# EAGLE design HotplateReflowSchematic (EAGLE 7.6.0)
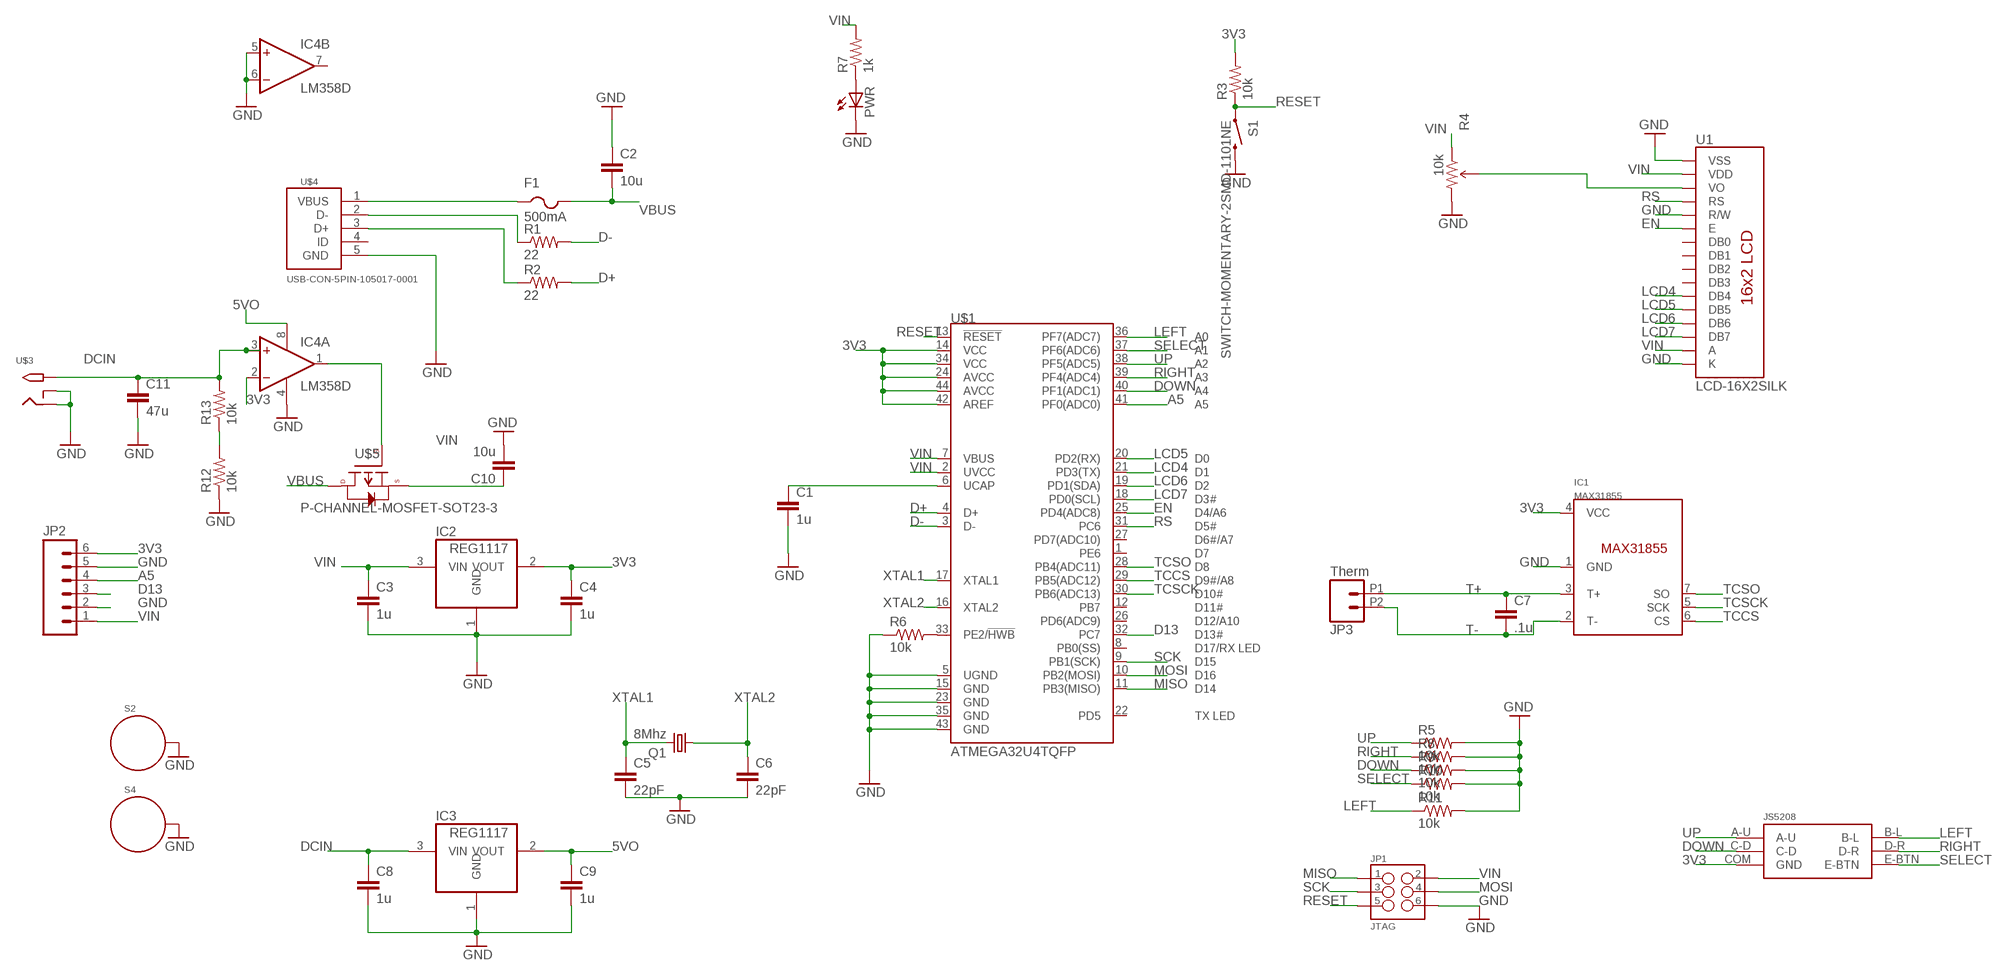
[diagram p0: schematic, sheet 1]

## Parts
C1  1u  CAP0603-CAP  [0603-CAP]
C2  10u  CAP0603-CAP  [0603-CAP]
C3  1u  CAP0603-CAP  [0603-CAP]
C4  1u  CAP0603-CAP  [0603-CAP]
C5  22pF  CAP0603-CAP  [0603-CAP]
C6  22pF  CAP0603-CAP  [0603-CAP]
C7  .1u  CAP0603-CAP  [0603-CAP]
C8  1u  CAP0603-CAP  [0603-CAP]
C9  1u  CAP0603-CAP  [0603-CAP]
C10  10u  CAP0603-CAP  [0603-CAP]
C11  47u  CAP0603-CAP  [0603-CAP]
F1  500mA  PTCFUSE-1812  [1812]
IC1  MAX31855  [SOIC8]
IC2  REG1117  [SOT223]
IC3  REG1117  [SOT223]
IC4  LM358D  [SO08]
JP1  JTAG  M03X2SHROUD  [2X3-SHROUDED]
JP2  M06LOCK  [1X06_LOCK]
JP3  Therm  M022.54MM_SCREWTERM  [1X02_2.54_SCREWTERM]
PWR  LEDCHIP-LED0603  [CHIP-LED0603]
Q1  8Mhz  CRYSTALHC49UP  [HC49UP]
R1  22  RESISTOR0603-RES  [0603-RES]
R2  22  RESISTOR0603-RES  [0603-RES]
R3  10k  RESISTOR0603-RES  [0603-RES]
R4  10k  TRIMPOT  [TRIMPOT-5MM-V2]
R5  10k  RESISTOR0603-RES  [0603-RES]
R6  10k  RESISTOR0603  [0603-RES]
R7  1k  RESISTOR0603  [0603-RES]
R8  10k  RESISTOR0603-RES  [0603-RES]
R9  10k  RESISTOR0603-RES  [0603-RES]
R10  10k  RESISTOR0603-RES  [0603-RES]
R11  10k  RESISTOR0603-RES  [0603-RES]
R12  10k  RESISTOR0603-RES  [0603-RES]
R13  10k  RESISTOR0603-RES  [0603-RES]
S1  SWITCH-MOMENTARY-2SMD-1101NE  [TACTILE-SWITCH-1101NE]
S2  STANDOFF_ELECTRICAL  [STANDOFF-ELECTRICAL]
S4  STANDOFF_ELECTRICAL  [STANDOFF-ELECTRICAL]
U1  LCD-16X2SILK  [LCD-16X2]
U$1  ATMEGA32U4TQFP  [SPARKFUN-DIGITALIC_TQFP44]
U$2  JS5208  [JS5208_PKG]
U$3  2.1MMJACKTHM  [PJ-102A]
U$4  USB-CON-5PIN-105017-0001  [USB-MICRO-MOLEX-105017-0001]
U$5  P-CHANNEL-MOSFET-SOT23-3  [SOT23-3]

## Nets
3V3: C4.1 IC1.4(VCC) IC2.2(VOUT) IC4.2(A:-IN) JP2.6 R3.2 U$1.14(VCC) U$1.24(AVCC) U$1.34(VCC) U$1.42(AREF) U$1.44(AVCC) U$2.COM(GND)
5VO: C9.1 IC3.2(VOUT) IC4.8(P:V+)
A5: JP2.4 U$1.41(PF0(ADC0))
D13: JP2.3 U$1.32(PC7)
D+: R2.2 U$1.4(D+)
D-: R1.2 U$1.3(D-)
DCIN: C8.1 C11.1 IC3.3(VIN) IC4.3(A:+IN) R13.2 U$3.TIP
DOWN: R9.1 U$1.40(PF1(ADC1)) U$2.C-D
EN: U1.6(E) U$1.25(PD4(ADC8))
GND: C1.2 C2.1 C3.2 C4.2 C5.2 C6.2 C8.2 C9.2 C10.2 C11.2 IC1.1(GND) IC2.1(GND) IC3.1(GND) IC4.4(P:V-) IC4.5(B:+IN) IC4.6(B:-IN) JP1.6 JP2.2 JP2.5 PWR.C R4.C(CW) R5.2 R6.1 R8.2 R9.2 R10.2 R11.2 R12.1 S1.2 S2.P1 S4.P1 U1.1(VSS) U1.5(R/W) U1.16(K) U$1.5(UGND) U$1.15(GND) U$1.23(GND) U$1.35(GND) U$1.43(GND) U$3.RING U$3.RING_SW U$4.5(GND)
LCD4: U1.11(DB4) U$1.21(PD3(TX))
LCD5: U1.12(DB5) U$1.20(PD2(RX))
LCD6: U1.13(DB6) U$1.19(PD1(SDA))
LCD7: U1.14(DB7) U$1.18(PD0(SCL))
LEFT: R11.1 U$1.36(PF7(ADC7)) U$2.B-L
MISO: JP1.1 U$1.11(PB3(MISO))
MOSI: JP1.4 U$1.10(PB2(MOSI))
N$1: R4.B(WIPER) U1.3(VO)
N$2: F1.1 U$4.1(VBUS)
N$3: R1.1 U$4.2(D-)
N$4: R2.1 U$4.3(D+)
N$5: C1.1 U$1.6(UCAP)
N$6: PWR.A R7.1
N$7: R6.2 U$1.33(PE2/!HWB)
N$8: R12.2 R13.1
N$9: IC4.1(A:OUT) U$5.1(G)
RESET: JP1.5 R3.1 S1.1 U$1.13(!RESET)
RIGHT: R8.1 U$1.39(PF4(ADC4)) U$2.D-R
RS: U1.4(RS) U$1.31(PC6)
SCK: JP1.3 U$1.9(PB1(SCK))
SELECT: R10.1 U$1.37(PF6(ADC6)) U$2.E-BTN
T+: C7.1 IC1.3(T+) JP3.P1
T-: C7.2 IC1.2(T-) JP3.P2
TCCS: IC1.6(CS) U$1.29(PB5(ADC12))
TCSCK: IC1.5(SCK) U$1.30(PB6(ADC13))
TCSO: IC1.7(SO) U$1.28(PB4(ADC11))
UP: R5.1 U$1.38(PF5(ADC5)) U$2.A-U
VBUS: C2.2 F1.2 U$5.3(D)
VIN: C3.1 C10.1 IC2.3(VIN) JP1.2 JP2.1 R4.A(CCW) R7.2 U1.2(VDD) U1.15(A) U$1.2(UVCC) U$1.7(VBUS) U$5.2(S)
XTAL1: C5.1 Q1.2 U$1.17(XTAL1)
XTAL2: C6.1 Q1.1 U$1.16(XTAL2)
Unconnected: IC4.7(B:OUT) U1.7(DB0) U1.8(DB1) U1.9(DB2) U1.10(DB3) U$1.1(PE6) U$1.8(PB0(SS)) U$1.12(PB7) U$1.22(PD5) U$1.26(PD6(ADC9)) U$1.27(PD7(ADC10)) U$4.4(ID)

## Library data of the parts
C1-C7 C11 = SparkFun-Passives:CAP: Capacitor Standard 0603 ceramic capacitor, and 0.1" leaded capacitor.
C8-C10 = SparkFun-Capacitors:CAP: Capacitor Standard 0603 ceramic capacitor, and 0.1" leaded capacitor.
F1 = adafruit:PTCFUSE: PTC fuses, resettable thermistors
IC1 = AlexW-Eagle-Libraries:MAX31855
IC2 IC3 = burr-brown:REG1117: 800mA and 1A Low Dropout (LDO) Positive Regulator 1.8V, 2.5V, 2.85V, 3.3V, 5V, and Adj; MPN: REG1117; OC_FARNELL: 1097566; OC_NEWARK: 14P6981
IC4 = linear:LM358: OP AMP also LM158; LM258; LM2904 Source: http://cache.national.com/ds/LM/LM158.pdf
JP1 = SparkFun-Connectors:M03X2: 2x3 .1" header. Shrouded, with keying- CONN-10681 SMT- CONN-11415 Pogo pins- HW-11044; PROD_ID: CONN-10681
JP2 = SparkFun-Connectors:M06: Header 6 Standard 6-pin 0.1" header. Use with straight break away headers (SKU : PRT-00116), right angle break away headers (PRT-00553), swiss pins (PRT-00743), machine pins (PRT-00117), and female headers (PRT-00115). Molex polarized connector foot print use with SKU : PRT-08094 with associated crimp pins and housings. NOTES ON THE VARIANTS LOCK and LOCK_LONGPADS... This footprint was designed to help hold the alignment of a through-hole component (i.e. 6-pin header) while soldering it into place. You may notice that each hole has been shifted either up or down by 0.005 of an inch from it's more standard position (which is a perfectly straight line). This slight alteration caused the pins (the squares in the middle) to touch the edges of the holes. Because they are alternating, it causes a "brace" to hold the component in place. 0.005 has proven to be the perfect amount of "off-center" position when using our standard breakaway headers. Although looks a little odd when you look at the bare footprint, once you have a header in there, the alteration is very hard to notice. Also,if you push a header all the way into place, it is covered up entirely on the bottom side. This idea of altering the position of holes to aid alignment will be further integrated into the Sparkfun Library for other footprints. It can help hold any component with 3 or more connection pins.
JP3 = SparkFun-Connectors:M02: Standard 2-pin 0.1" header. Use with - straight break away headers ( PRT-00116) - right angle break away headers (PRT-00553) - swiss pins (PRT-00743) - machine pins (PRT-00117) - female headers (PRT-00115) Molex polarized connector foot print use with: PRT-08233 with associated crimp pins and housings. 2.54_SCREWTERM for use with PRT-10571. 3.5mm Screw Terminal footprints for PRT-08084 5mm Screw Terminal footprints for use with PRT-08432
PWR = adafruit:LED: LED OSRAM: - CHIPLED LG R971, LG N971, LY N971, LG Q971, LY Q971, LO R971, LY R971 LH N974, LH R974 LS Q976, LO Q976, LY Q976 LO Q996 - Hyper CHIPLED LW Q18S LB Q993, LB Q99A, LB R99A - SideLED LS A670, LO A670, LY A670, LG A670, LP A670 LB A673, LV A673, LT A673, LW A673 LH A674 LY A675 LS A676, LA A676, LO A676, LY A676, LW A676 LS A679, LY A679, LG A679 - Hyper Micro SIDELED® LS Y876, LA Y876, LO Y876, LY Y876 LT Y87S - SmartLED LW L88C, LW L88S LB L89C, LB L89S, LG L890 LS L89K, LO L89K, LY L89K LS L896, LA L896, LO L896, LY L896 - TOPLED LS T670, LO T670, LY T670, LG T670, LP T670 LSG T670, LSP T670, LSY T670, LOP T670, LYG T670 LG T671, LOG T671, LSG T671 LB T673, LV T673, LT T673, LW T673 LH T674 LS T676, LA T676, LO T676, LY T676, LB T676, LH T676, LSB T676, LW T676 LB T67C, LV T67C, LT T67C, LS T67K, LO T67K, LY T67K, LW E67C LS E67B, LA E67B, LO E67B, LY E67B, LB E67C, LV E67C, LT E67C LW T67C LS T679, LY T679, LG T679 LS T770, LO T770, LY T770, LG T770, LP T770 LB T773, LV T773, LT T773, LW T773 LH T774 LS E675, LA E675, LY E675, LS T675 LS T776, LA T776, LO T776, LY T776, LB T776 LHGB T686 LT T68C, LB T68C - Hyper Mini TOPLED® LB M676 - Mini TOPLED Santana® LG M470 LS M47K, LO M47K, LY M47K Source: http://www.osram.convergy.de/
Q1 = adafruit:CRYSTAL: CRYSTAL; OC_FARNELL: unknown; OC_NEWARK: unknown
R1-R3 R5 R8-R13 = SparkFun-Passives:RESISTOR: Resistor Basic schematic elements and footprints for 0603, 1206, and PTH resistors.
R4 = SparkFun-Electromechanical:TRIMPOT: Various small potentiometers for "set-and-forget" applications
R6 R7 = SparkFun-Resistors:RESISTOR: Resistor Basic schematic elements and footprints for 0603, 1206, and PTH resistors.
S1 = SparkFun-Electromechanical:SWITCH-MOMENTARY-2: Various NO switches- pushbuttons, reed, etc; PROD_ID: SWCH-00815
S2 S4 = SparkFun-Electromechanical:STANDOFF_ELECTRICAL: A standoff intended to be an electrically connected point. Pad size and stop size allow for a #4 Phillips pan screw head to make a solid connection to the board.
U1 = SparkFun-Displays:LCD-16X2: Standard text-only 16x2 parallel input LCD
U$1 = SparkFun-Retired:ATMEGA32U4: Atmel 44-pin 8-bit Microcontroller with 32KBytes of ISP Flash and USB Controller ----- Please use the QFN-44-NOPAD_1:1 package for the footprint of all boards using a 32U4. Route traces directly away from the pads as much as possible.; PROD_ID: IC-11161
U$2 = eswitch_js5208:JS5208
U$3 = adafruit:2.1MMJACK: 2.1mm x 5.5mm THM DC jack with internal switch. Digikey part #PJ-102A, 4UCON part #05537 2.1mm x 5.5mm SMT DC jack with internal switch. Digikey part #PJ-002A-SMT, 4UCON part #03267 By microbuilder.eu & adafruit.com
U$4 = GeekAmmo:USB-CON-5PIN: Molex Micro USB 105017-0001
U$5 = GeekAmmo:P-CHANNEL-MOSFET: P-Channel MOSFET Mode Field Effect Transistor

## Board
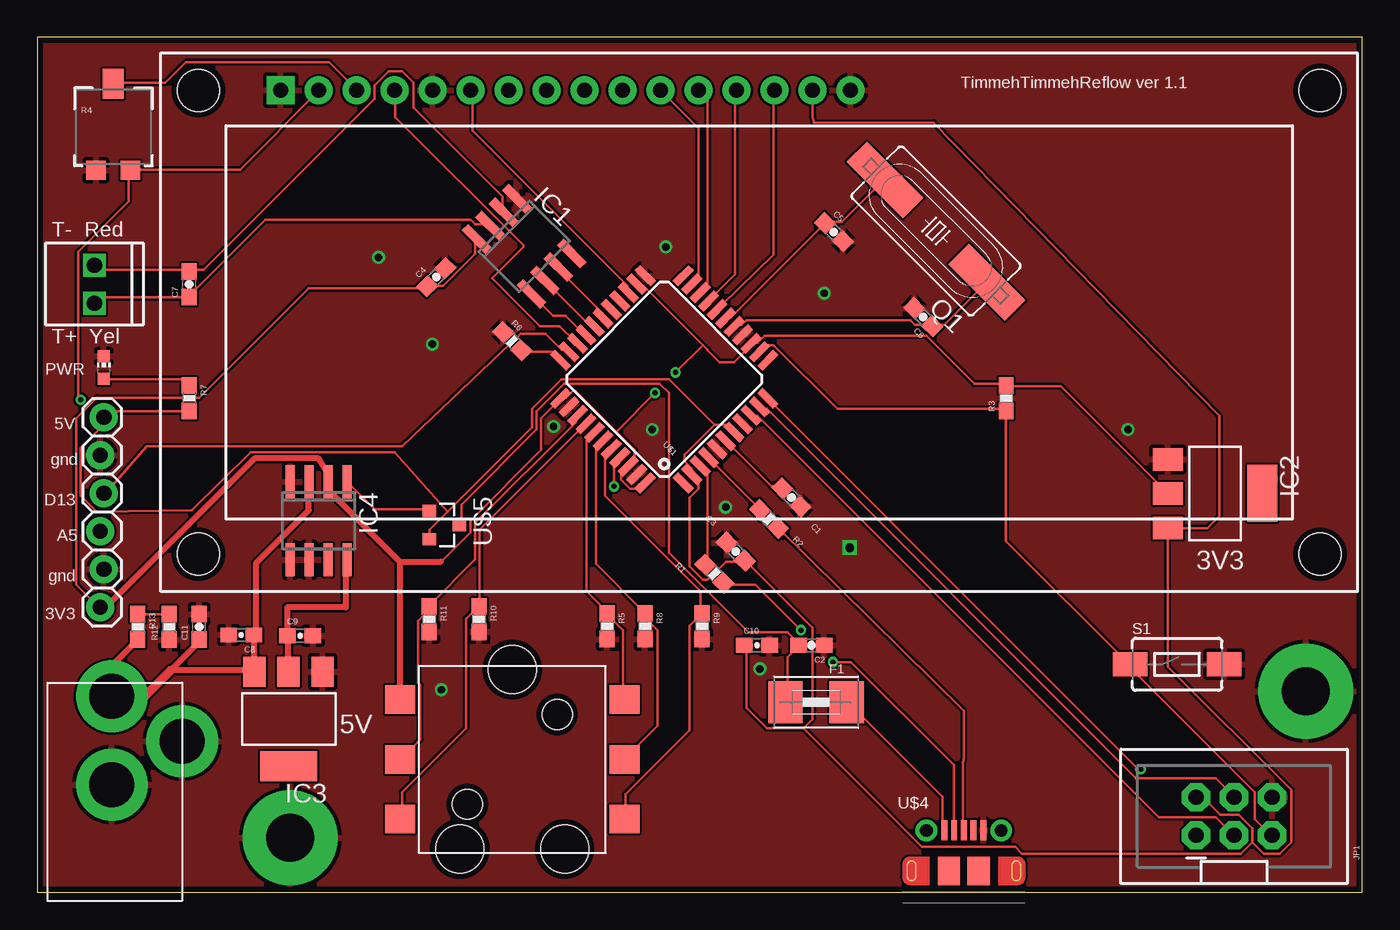
[diagram p1: board, top side]
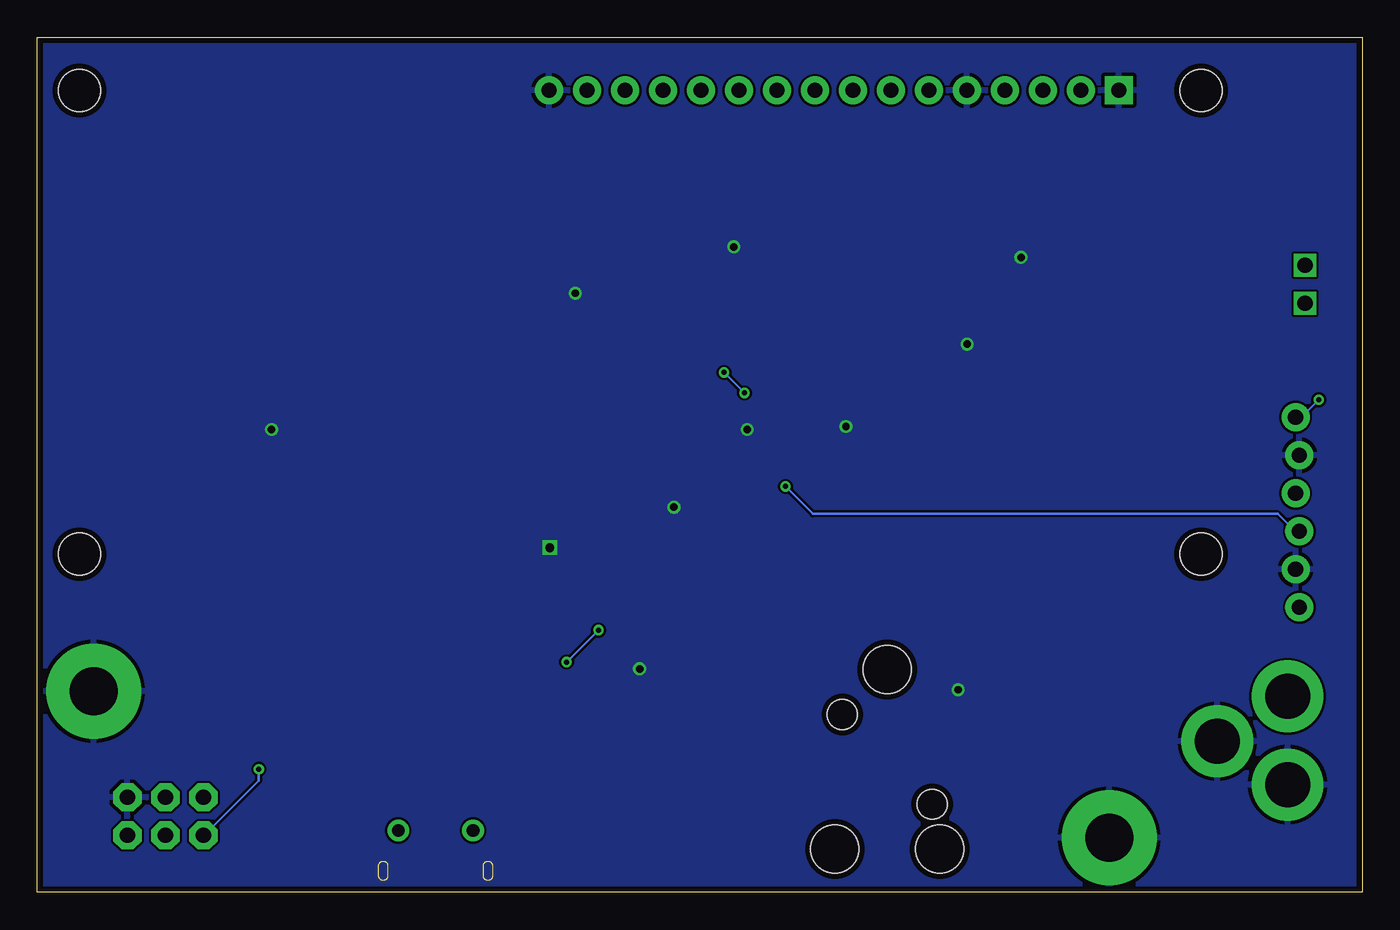
[diagram p2: board, bottom side, seen from below]

Size 88.57 x 57.14 mm. Coordinates in mm from the lower left corner, seen from the top.
Outline: 0,0 88.57,0 88.57,57.14 0,57.14 0,0
Copper layers (1*16): Top 0.0356mm / dielectric 1.5011mm / Bottom 0.0356mm
Design rules "LaenPCBOrder": minimum track width 6mil, minimum drill 13mil, track to track 6mil, track to pad 6mil, pad to pad 6mil, via to via 6mil, smd to smd 6mil, copper to edge 15mil, drill to drill 6mil, minimum pad ring 7mil, minimum via ring 7mil, stop-mask expansion 3mil, vias tented up to drill 0mil, thermal gap 10mil

### Footprints (pad centres in the part's own frame; a part is rotated, then mirrored left to right if it is on the bottom)
0603-CAP = smd 1.1 x 1: 1 -0.85,0; 2 0.85,0
1812 = smd 2.286 x 2.794: 1 -2.046,0; 2 2.046,0
SOIC8 = smd 0.6 x 2.2: 1 -1.905,-2.6; 2 -0.635,-2.6; 3 0.635,-2.6; 4 1.905,-2.6; 5 1.905,2.6; 6 0.635,2.6; 7 -0.635,2.6; 8 -1.905,2.6
SOT223 = smd 1.499 x 2.007: 1 -2.261,-3.15; 2 0.025,-3.15; 3 2.311,-3.15 | smd 3.81 x 2.007: 4 0,3.15
SO08 = smd 0.6 x 2.2: 1 -1.905,-2.6; 2 -0.635,-2.6; 3 0.635,-2.6; 4 1.905,-2.6; 5 1.905,2.6; 6 0.635,2.6; 7 -0.635,2.6; 8 -1.905,2.6
2X3-SHROUDED = drill 1.016 pad 1.88 octagon: 1 -1.27,2.54; 2 1.27,2.54; 3 -1.27,0; 4 1.27,0; 5 -1.27,-2.54; 6 1.27,-2.54
1X06_LOCK = drill 1.016 pad 1.88: 1 0,0; 2 2.54,-0.254; 3 5.08,0; 4 7.62,-0.254; 5 10.16,0; 6 12.7,-0.254
1X02_2.54_SCREWTERM = drill 1.016 square: P1 2.54,0; P2 0,0
CHIP-LED0603 = smd 0.8 x 0.8: A 0,-0.75; C 0,0.75
HC49UP = smd 5.334 x 1.93: 1 -4.826,0; 2 4.826,0
0603-RES = smd 1.1 x 1: 1 -0.85,0; 2 0.85,0
TRIMPOT-5MM-V2 = smd 1.3 x 1.3: A 1.15,-2.54; C -1.15,-2.54 | smd 1.402 x 2: B 0,3.239
TACTILE-SWITCH-1101NE = smd 2.3 x 1.6: 1 -3.15,0; 2 3.15,0
STANDOFF-ELECTRICAL = drill 3.2 pad 6.35: P1 0,0
LCD-16X2 = drill 1.016 pad 1.88 square: 1 -32,15.5 | drill 1.016 pad 1.88: 2 -29.46,15.5; 3 -26.92,15.5; 4 -24.38,15.5; 5 -21.84,15.5; 6 -19.3,15.5; 7 -16.76,15.5; 8 -14.22,15.5; 9 -11.68,15.5; 10 -9.14,15.5; 11 -6.6,15.5; 12 -4.06,15.5; 13 -1.52,15.5; 14 1.02,15.5; 15 3.56,15.5; 16 6.1,15.5 | hole 2.8: -37.5,15.5; -37.5,-15.5; 37.5,15.5; 37.5,-15.5
SPARKFUN-DIGITALIC_TQFP44 = smd 1.5 x 0.5: 1 -5.8,4; 2 -5.8,3.2; 3 -5.8,2.4; 4 -5.8,1.6; 5 -5.8,0.8; 6 -5.8,0; 7 -5.8,-0.8; 8 -5.8,-1.6; 9 -5.8,-2.4; 10 -5.8,-3.2; 11 -5.8,-4; 23 5.8,-4; 24 5.8,-3.2; 25 5.8,-2.4; 26 5.8,-1.6; 27 5.8,-0.8; 28 5.8,0; 29 5.8,0.8; 30 5.8,1.6; 31 5.8,2.4; 32 5.8,3.2; 33 5.8,4 | smd 0.5 x 1.5: 12 -4,-5.8; 13 -3.2,-5.8; 14 -2.4,-5.8; 15 -1.6,-5.8; 16 -0.8,-5.8; 17 0,-5.8; 18 0.8,-5.8; 19 1.6,-5.8; 20 2.4,-5.8; 21 3.2,-5.8; 22 4,-5.8; 34 4,5.8; 35 3.2,5.8; 36 2.4,5.8; 37 1.6,5.8; 38 0.8,5.8; 39 0,5.8; 40 -0.8,5.8; 41 -1.6,5.8; 42 -2.4,5.8; 43 -3.2,5.8; 44 -4,5.8
JS5208_PKG = smd 2 x 1.9: A-U 7.5,4; B-L -7.5,0; C-D 7.5,-4; COM -7.5,4; D-R 7.5,0; E-BTN -7.5,-4 | hole 3.2: -3.5,-6; 3.5,-6; 0,6 | hole 2: -3,-3; 3,3
PJ-102A = drill 3 pad 4.8: RING 0.1,-3.39; RING_SW -4.6,-6.29; TIP 0.1,-9.29
USB-MICRO-MOLEX-105017-0001 = smd 0.4 x 1.35: 1 1.2,0; 2 1.85,0; 3 2.5,0; 4 3.15,0; 5 3.8,0 | drill 0.85 pad 1.45: P$1 0,0; P$2 5,0 | smd 1.5 x 1.9: P$3 3.5,-2.7; P$4 1.5,-2.7
SOT23-3 = smd 0.8 x 0.9: 1 -0.95,-1; 2 0.95,-1; 3 0,1

### Placement (x,y rotation side)
C1  50.41,26.39 315 top
C2  51.75,16.51 180 top
C3  46.69,22.77 135 top
C4  26.67,41.12 45 top
C5  53.25,44.13 315 top
C6  59.23,38.45 135 top
C7  10.16,40.64 90 top
C8  13.64,17.2 180 top
C9  17.58,17.14 0 top
C10  48.1,16.51 0 top
C11  10.81,17.74 90 top
F1  52.07,12.7 180 top
IC1  32.54,43.18 225 top
IC2  78.74,26.67 270 top
IC3  16.81,11.59 180 top
IC4  18.81,24.84 180 top
JP1  80.01,5.08 90 top
JP2  4.45,31.75 270 top
JP3  3.81,41.91 270 top
PWR  4.45,35.08 0 top
Q1  60.08,44.2 135 top
R1  45.26,21.3 135 top
R2  48.91,24.95 135 top
R3  64.77,33.02 90 top
R4  5.08,50.8 0 top
R5  38.1,17.78 270 top
R6  31.75,36.83 315 top
R7  10.16,33.02 270 top
R8  40.64,17.78 270 top
R9  44.45,17.78 270 top
R10  29.53,18.26 270 top
R11  26.19,18.26 270 top
R12  8.81,17.74 90 top
R13  6.71,17.74 270 top
S1  76.2,15.24 0 top
S2  84.81,13.44 0 top
S4  16.91,3.64 0 top
U1  48.26,38.1 0 top
U$1  41.91,34.29 135 top
U$2  31.75,8.89 0 top
U$3  5.08,3.81 180 top
U$4  59.45,4.14 0 top
U$5  27.21,24.54 270 top

### Tracks (layer width: path | path; a pad name or v marks a point on that pad's centre or on a via)
3V3  (via drill 0.33)
  Top 0.152: 44.5,36.58 44.81,36.27 44.81,36.24 45.61,35.44 46.57,35.44 47.7,36.58 U$1.14 47.85,36.73 48.16,36.73 48.62,37.19 59.44,37.19 62.64,33.98 64.77,33.98 R3.2 64.77,33.83 68.43,33.83 75.59,26.67 IC2.2 | 44.5,36.58 40.54,40.54 40.08,40.54 U$1.24 | U$1.44 40.54,27.28 40.23,27.28 39.93,26.98 39.62,26.98 39.01,27.58 39.01,27.89 39.47,28.35 U$1.42 39.62,28.5 39.93,28.8 39.93,29.57 38.71,30.79 | 38.71,30.79 35.97,33.53 35.81,33.53 35.36,33.07 35.05,33.07 U$1.34 34.9,32.92 34.9,32.91 33.68,31.69 33.68,29.57 28.96,24.84 28.96,24.08 26.97,22.1 | IC1.4 29.26,43.59 29.26,42.67 27.13,40.54 26.21,40.54 C4.1 26.06,40.39 18.14,40.39 10.82,33.07 3.96,33.07 2.59,31.7 2.59,20.57 4.12,19.05 JP2.6 4.57,19.05 | 19.66,26.67 19.66,27.28 19.51,27.43 | 24.23,12.95 U$2.COM | 19.51,27.43 19.51,27.89 | v42.67,34.75 44.5,36.58 | 38.71,30.79 v41.3,33.38 | 19.51,27.43 19.5,27.44 IC4.2
  Top 0.406: 24.23,22.1 24.23,12.95 | 19.66,26.67 24.23,22.1 | 4.57,19.05 14.53,29 18.79,29 19.51,27.89 | 24.23,22.1 26.97,22.1
  Bottom 0.152: v41.3,33.38 v42.67,34.75
5VO
  Top 0.152: 16.76,17.07 C9.1 16.71,17.16 | 16.76,14.78 IC3.2 | IC4.8 20.61,22.13
  Top 0.406: 16.76,14.78 16.76,17.07 | 20.61,22.13 20.61,19.04 16.71,19.04 16.71,17.16
A5  (via drill 0.33)
  Top 0.152: v38.56,27.13 38.56,28.35 38.86,28.65 38.86,28.96 U$1.41
  Bottom 0.152: v38.56,27.13 36.73,25.3 5.64,25.3 4.57,24.23 4.27,24.23 JP2.4
D13
  Top 0.152: U$1.32 35.51,36.27 35.05,36.27 33.98,37.34 32.31,37.34 24.38,29.81 7.31,29.81 4.57,26.67 JP2.3
D+
  Top 0.152: R2.2 48.31,25.6 44.96,28.96 U$1.4
D-
  Top 0.152: R1.2 44.81,21.95 44.81,27.89 44.35,28.35 U$1.3
DCIN
  Top 0.152: 14.63,17.22 C8.1 | IC4.3 18.14,27.4 | C8.1 | C11.1 10.81,16.74 | 6.31,12.24 6.21,12.14 5.94,12.14 U$3.TIP | C8.1 14.49,14.86 14.51,14.84
  Top 0.406: 18.14,27.4 18.14,25.55 14.63,22.04 14.63,17.22 | IC3.3 C8.1 | U$3.TIP 4.98,15.16 R13.2 | 10.81,16.74 8.91,14.84 14.51,14.84
  Top 0.61: 8.91,14.84 6.31,12.24
DOWN
  Top 0.152: U$1.40 38.25,29.47 37.95,29.16 37.95,26.52 44.35,20.12 44.35,18.74 R9.1 44.35,18.59 43.59,17.83 43.59,10.82 39.32,6.55 39.32,5.03 U$2.C-D
EN
  Top 0.152: U$1.25 39.47,40.23 39.47,40.54 29.11,50.9 29.11,53.49 U1.6
GND  (via drill 0.5 pad 0.25, 0.6)
  other vias: 54.31,23.04 34.51,31.14 72.91,30.94 46.01,25.74 42.01,43.14 52.61,40.04 22.81,42.44 26.41,36.64 41.11,30.94 48.31,14.94 27.01,13.54
  pour Top: 0,57.15 0,0 88.9,0 88.9,57.15
  pour Bottom: 0,57.15 0,0 88.9,0 88.9,57.15
LCD4
  Top 0.152: U$1.21 43.89,40.69 43.89,40.75 44.2,41.05 44.2,51.05 41.76,53.49 U1.11
LCD5
  Top 0.152: U$1.20 44.35,40.23 44.55,40.44 44.81,40.7 44.81,53.03 44.35,53.49 U1.12
LCD6
  Top 0.152: U$1.19 44.96,39.62 45.36,40.03 46.63,41.31 46.63,53.49 U1.13
LCD7
  Top 0.152: U$1.18 45.57,39.01 45.77,39.27 49.23,42.63 49.23,53.49 U1.14
LEFT
  Top 0.152: U$2.B-L 24.38,8.99 25.6,10.21 25.6,13.87 25.45,14.02 25.45,18.14 26.06,18.74 26.06,19.05 R11.1 26.21,19.2 29.26,22.25 29.26,24.69 35.97,31.39 35.97,31.85 U$1.36
MISO  (via drill 0.33)
  Top 0.152: v73.76,8.23 73.61,8.23 48.92,32.92 U$1.11
  Bottom 0.152: v73.76,8.23 73.76,7.47 77.42,3.81 JP1.1
MOSI
  Top 0.152: U$1.10 48.31,32.31 48.77,32.31 73.46,7.62 78.79,7.62 80.01,6.4 JP1.4
N$1
  Top 0.152: R4.B 5.18,54.1 8.53,54.1 9.91,55.47 19.51,55.47 21.34,53.64 U1.3
N$2
  Top 0.152: U$4.1 60.5,4.27 60.5,6.4 54.25,12.65 F1.1
N$3  (via drill 0.33)
  Top 0.152: v51.05,17.53 48.01,20.57 45.87,20.57 R1.1 | v53.19,15.39 54.41,15.39 61.27,8.53 61.27,4.27 U$4.2
  Bottom 0.152: v53.19,15.39 v51.05,17.53
N$4
  Top 0.152: R2.1 61.93,12.13 61.93,8.93 61.87,8.69 61.87,4.27 U$4.3
N$5
  Top 0.152: C1.1 49.68,27.13 49.07,27.13 46.03,30.17 U$1.6
N$6
  Top 0.152: PWR.A 4.57,34.29 9.75,34.29 10.06,33.98 R7.1
N$7
  Top 0.152: R6.2 32.46,36.12 34.44,36.12 34.9,35.66 U$1.33
N$8
  Top 0.152: R12.2 R13.1
N$9
  Top 0.152: U$5.1 26.06,25.6 22.55,25.6 IC4.1
RESET
  Top 0.152: U$1.13 48.31,36.27 48.62,36.58 49.23,36.58 53.49,32.31 64.77,32.31 R3.1 64.77,23.47 73,15.24 S1.1 73.15,15.24 73.15,14.94 81.38,6.71 81.38,4.88 82.45,3.81 JP1.5
RIGHT
  Top 0.152: U$2.D-R 39.32,8.99 41.45,11.12 41.45,17.53 40.69,18.29 40.69,18.59 R8.1 40.54,18.74 37.34,21.95 37.34,29.71 37.8,30.17 U$1.39
RS
  Top 0.152: U$1.31 35.97,36.73 35.97,36.78 34.91,37.84 33.61,37.84 30.41,41.04 32.51,43.14 32.5,43.24 23.93,51.82 23.93,53.49 U1.4
SCK
  Top 0.152: JP1.3 78.79,5.03 74.98,5.03 48.16,31.85 47.85,31.85 U$1.9
SELECT
  Top 0.152: U$1.37 36.58,31.24 29.57,24.23 29.57,19.2 R10.1 29.41,19.05 28.65,18.29 28.65,10.97 24.38,6.71 24.38,5.03 U$2.E-BTN
T+
  Top 0.152: JP3.P1 3.81,39.47 4.12,39.78 10.06,39.78 C7.1 10.21,39.93 15.24,44.96 28.96,44.96 29.26,44.65 30.17,44.65 IC1.3
T-
  Top 0.152: JP3.P2 4.12,41.61 10.06,41.61 C7.2 10.21,41.61 11.12,41.61 22.55,53.03 22.55,53.95 23.47,54.86 24.38,54.86 25.15,54.1 25.15,52.43 31.09,46.48 31.09,45.57 IC1.2
TCCS
  Top 0.152: U$1.29 37.19,37.95 36.88,37.95 33.98,40.84 IC1.6
TCSCK
  Top 0.152: U$1.30 36.59,37.26 35.31,38.54 34.49,38.54 IC1.5
TCSO
  Top 0.152: U$1.28 37.8,38.41 37.8,38.71 34.75,41.76 IC1.7
UP
  Top 0.152: U$2.A-U 39.17,12.95 39.17,17.53 38.1,18.59 R5.1 38.1,18.74 36.73,20.12 36.73,30.17 37.19,30.63 U$1.38
VBUS
  Top 0.152: U$5.3 28.35,24.69 28.35,25.91 33.38,30.94 33.38,32.16 35.2,33.98 41.61,33.98 42.22,33.38 42.22,22.71 47.55,17.37 50.14,17.37 50.9,16.61 C2.2 50.9,16.46 50.14,15.7 50.14,12.8 F1.2
VIN  (via drill 0.33)
  Top 0.152: 81.23,3.35 81.99,2.59 83.06,2.59 83.82,3.35 83.82,6.86 75.59,15.09 IC2.3 75.61,24.34 78.21,24.34 79.01,25.14 79.01,31.84 59.91,51.44 51.91,51.44 51.82,51.83 U1.15 | 81.23,3.35 81.23,4.27 80.31,5.18 79.1,5.18 78.03,6.25 77.57,6.25 JP1.2 | U1.2 18.75,53.49 13.56,48.31 6.25,48.31 R4.A 6.1,48.16 6.1,46.18 2.74,42.82 2.74,33.07 v2.9,32.92 | 51.21,10.97 48.77,10.97 47.4,12.34 47.4,16.46 C10.1 | 51.21,10.97 51.82,11.58 51.82,17.68 47.4,22.1 C3.1 47.24,22.1 46.03,22.1 44.81,20.88 44.5,20.88 43.59,21.79 43.59,26.37 44.2,26.98 44.2,27.58 43.89,27.89 U$1.2 43.74,28.04 43.74,28.35 43.28,28.8 43.28,29.26 45.26,31.24 | R7.2 10.06,32.16 4.88,32.16 4.57,31.85 JP2.1 4.42,31.7 4.42,31.24 2.9,29.72 2.9,26.52 3.96,25.45 10.32,25.55 14.27,29.41 23.87,29.41 27.43,25.45 | 27.43,25.45 33.07,31.09 33.07,32.31 35.05,34.29 42.22,34.29 45.26,31.24 | 27.43,25.45 26.21,24.23 26.21,23.62 U$5.2 | 45.26,31.24 46.03,31.24 46.48,30.79 U$1.7 | 81.23,3.35 80.47,2.59 65.84,2.59 65.38,3.05 59.13,3.05 51.21,10.97
  Bottom 0.152: v2.9,32.92 3.96,31.85 4.42,31.85 JP2.1
XTAL1
  Top 0.152: Q1.2 56.54,47.55 53.8,44.81 52.73,44.81 C5.1 52.58,44.65 46.33,38.41 46.03,38.41 U$1.17
XTAL2
  Top 0.152: Q1.1 63.4,40.69 60.66,37.95 59.89,37.95 C6.1 59.74,37.95 58.67,37.95 58.37,38.25 47.4,38.25 47.09,37.95 46.63,37.95 U$1.16

### Text on the board
tPlace: TimmehTimmehReflow ver 1.1 | T- Red | T+ Yel | 5V | gnd | D13 | A5 | gnd | 3V3
tNames: 3V3 | 5V